# EAGLE schematic headphone_signal (EAGLE 5.06)
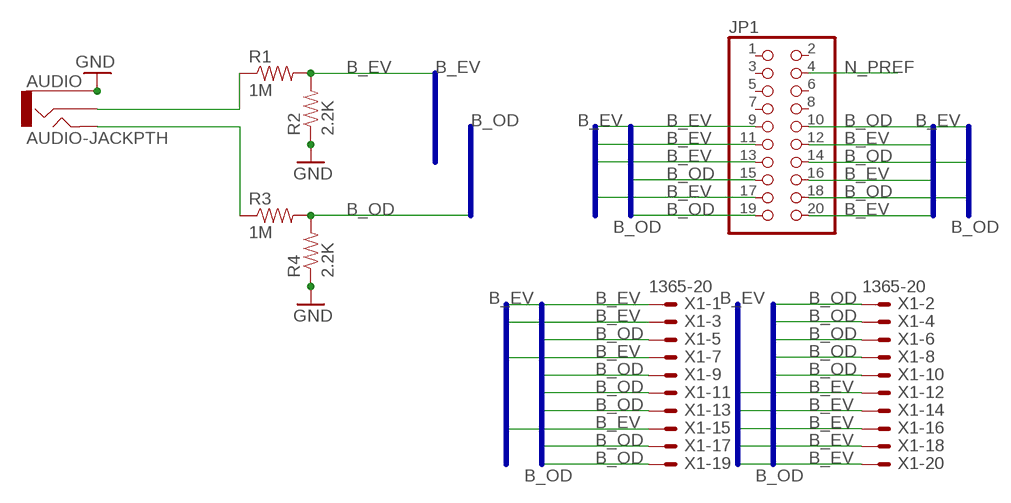
[diagram p0: schematic, sheet 1]

## Parts
AUDIO  AUDIO-JACKPTH  [AUDIO-JACK]
JP1  PINHD-2X10  [2X10]
R1  1M  RESISTORPTH1  [AXIAL-0.3]
R2  2.2K  RESISTORPTH1  [AXIAL-0.3]
R3  1M  RESISTORPTH1  [AXIAL-0.3]
R4  2.2K  RESISTORPTH1  [AXIAL-0.3]
X1  1365-20  [1365-20]

## Nets
B_EV: JP1.9 JP1.11 JP1.12 JP1.13 JP1.16 JP1.17 JP1.20 R1.P$2 R2.P$2 X1.1 X1.3 X1.7 X1.12 X1.14 X1.15 X1.16 X1.18 X1.20
B_OD: JP1.10 JP1.14 JP1.15 JP1.18 JP1.19 R3.P$2 R4.P$2 X1.2 X1.4 X1.5 X1.6 X1.8 X1.9 X1.10 X1.11 X1.13 X1.17 X1.19
GND: AUDIO.1 R2.P$1 R4.P$1
N$4: AUDIO.2 R1.P$1
N$5: AUDIO.5 R3.P$1
N_PREF: JP1.4
Unconnected: JP1.1 JP1.2 JP1.3 JP1.5 JP1.6 JP1.7 JP1.8

## Buses
B_OD
B_EV

## Library data of the parts
AUDIO = SparkFun:AUDIO-JACK: 3.5mm Audio Jack Simple 3.5mm common PCB mount audio jack. SKU: PRT-08032
JP1 = pinhead:PINHD-2X10: PIN HEADER
R1-R4 = SparkFun:RESISTOR: Resistor Basic schematic elements and footprints for 0603, 1206, and PTH 1/10th watt (small) resistors.
X1 = con-leotronics:1365-20: DUAL ROW STRAIGHT HEADER 1364 SERIES. 1.27mm x 1.27mm. Without Fixing Post. SMT Source: http://www.leotronics.co.uk/Conexcon/Data%20Sheets/sec.%20A/1364ing.pdf